# EAGLE design RCT-433-UTR_Transmitter (EAGLE 5.10)
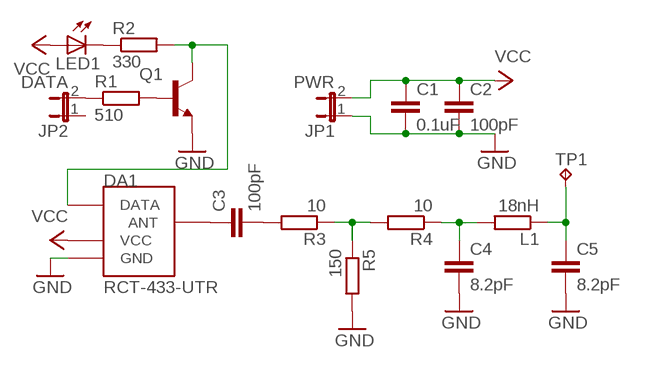
[diagram p0: schematic, sheet 1]

## Parts
C1  0.1uF  C-EUC0805  [C0805]
C2  100pF  C-EUC0805  [C0805]
C3  100pF  C-EUC0805  [C0805]
C4  8.2pF  C-EUC0805  [C0805]
C5  8.2pF  C-EUC0805  [C0805]
DA1  RCT-433-UTR  [RCT-433-UTR]
JP1  PWR  JP1E  [JP1]
JP2  DATA  JP1E  [JP1]
L1  18nH  R-EU_R0805  [R0805]
LED1  LEDCHIP-LED0805  [CHIP-LED0805]
Q1  BC817-16LT1SMD  [SOT23-BEC]
R1  510  R-EU_R0805  [R0805]
R2  330  R-EU_R0805  [R0805]
R3  10  R-EU_R0805  [R0805]
R4  10  R-EU_R0805  [R0805]
R5  150  R-EU_R0805  [R0805]
TP1  TPB2,54  [B2,54]

## Nets
GND: C1.2 C2.2 C4.2 C5.2 DA1.GND JP1.1 Q1.E R5.2
N$1: C3.1 DA1.ANT
N$2: JP2.2 R1.1
N$3: Q1.B R1.2
N$4: LED1.C R2.1
N$5: DA1.DATA Q1.C R2.2
N$6: C3.2 R3.2
N$7: R3.1 R4.2 R5.1
N$8: C5.1 L1.1 TP1.PP(TP)
N$9: C4.1 L1.2 R4.1
VCC: C1.1 C2.1 DA1.VCC JP1.2 LED1.A
Unconnected: JP2.1

## Library data of the parts
C1-C5 = rcl:C-EU: CAPACITOR, European symbol
DA1 = radiotronix:RCT-433-UTR: RCT-433-UTR Radiotronix RCT-433-UTR 433 MHz transmitter. Antenna length = 17.2cm for 433MHz
JP1 JP2 = jumper:JP1E: JUMPER
L1 R1-R5 = resistor:R-EU_: RESISTOR, European symbol
LED1 = led:LED: LED OSRAM: - CHIPLED LG R971, LG N971, LY N971, LG Q971, LY Q971, LO R971, LY R971 LH N974, LH R974 LS Q976, LO Q976, LY Q976 LO Q996 - Hyper CHIPLED LW Q18S LB Q993, LB Q99A, LB R99A - SideLED LS A670, LO A670, LY A670, LG A670, LP A670 LB A673, LV A673, LT A673, LW A673 LH A674 LY A675 LS A676, LA A676, LO A676, LY A676, LW A676 LS A679, LY A679, LG A679 - Hyper Micro SIDELED® LS Y876, LA Y876, LO Y876, LY Y876 LT Y87S - SmartLED LW L88C, LW L88S LB L89C, LB L89S, LG L890 LS L89K, LO L89K, LY L89K LS L896, LA L896, LO L896, LY L896 - TOPLED LS T670, LO T670, LY T670, LG T670, LP T670 LSG T670, LSP T670, LSY T670, LOP T670, LYG T670 LG T671, LOG T671, LSG T671 LB T673, LV T673, LT T673, LW T673 LH T674 LS T676, LA T676, LO T676, LY T676, LB T676, LH T676, LSB T676, LW T676 LB T67C, LV T67C, LT T67C, LS T67K, LO T67K, LY T67K, LW E67C LS E67B, LA E67B, LO E67B, LY E67B, LB E67C, LV E67C, LT E67C LW T67C LS T679, LY T679, LG T679 LS T770, LO T770, LY T770, LG T770, LP T770 LB T773, LV T773, LT T773, LW T773 LH T774 LS E675, LA E675, LY E675, LS T675 LS T776, LA T776, LO T776, LY T776, LB T776 LHGB T686 LT T68C, LB T68C - Hyper Mini TOPLED® LB M676 - Mini TOPLED Santana® LG M470 LS M47K, LO M47K, LY M47K Source: http://www.osram.convergy.de LUXEON: - LUMILED® LXK2-PW12-R00, LXK2-PW12-S00, LXK2-PW14-U00, LXK2-PW14-V00 LXK2-PM12-R00, LXK2-PM12-S00, LXK2-PM14-U00 LXK2-PE12-Q00, LXK2-PE12-R00, LXK2-PE12-S00, LXK2-PE14-T00, LXK2-PE14-U00 LXK2-PB12-K00, LXK2-PB12-L00, LXK2-PB12-M00, LXK2-PB14-N00, LXK2-PB14-P00, LXK2-PB14-Q00 LXK2-PR12-L00, LXK2-PR12-M00, LXK2-PR14-Q00, LXK2-PR14-R00 LXK2-PD12-Q00, LXK2-PD12-R00, LXK2-PD12-S00 LXK2-PH12-R00, LXK2-PH12-S00 LXK2-PL12-P00, LXK2-PL12-Q00, LXK2-PL12-R00 Source: www.luxeon.com KINGBRIGHT: KA-3528ASYC Source: www.kingbright.com
Q1 = transistor-npn:BC817*: NPN Transistor
TP1 = testpad:TP: Test pad

## Board
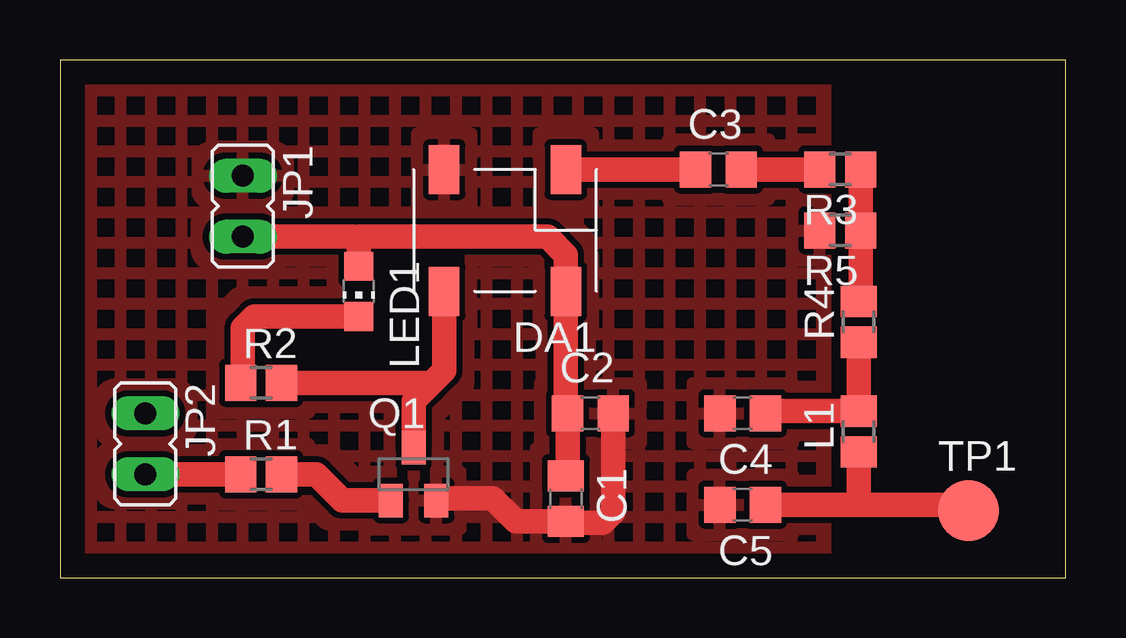
[diagram p1: board, top side]

Size 41.91 x 21.59 mm. Coordinates in mm from the lower left corner, seen from the top.
Outline: 0,0 41.91,0 41.91,21.59 0,21.58 0,0
Copper layers (1*16): Top 0.035mm / dielectric 1.5mm / Bottom 0.035mm
Design rules "default": minimum track width 10mil, minimum drill 24mil, track to track 8mil, track to pad 8mil, pad to pad 8mil, via to via 8mil, smd to smd 8mil, copper to edge 40mil, drill to drill 8mil, minimum pad ring 10mil, minimum via ring 8mil, stop-mask expansion 4mil, vias tented up to drill 0mil, thermal gap 10mil
tRestrict: area 32.4,0 to 41.9,21.6

### Footprints (pad centres in the part's own frame; a part is rotated, then mirrored left to right if it is on the bottom)
C0805 = smd 1.3 x 1.5: 1 -0.95,0; 2 0.95,0
RCT-433-UTR = smd 1.27 x 2.032: ANT 0,0; DATA 5.08,5.08; GND 5.08,0; VCC 0,5.08
JP1 = drill 0.914 long: 1 0,-1.27; 2 0,1.27
R0805 = smd 1.3 x 1.5: 1 -0.85,0; 2 0.85,0
CHIP-LED0805 = smd 1.2 x 1.2: A 0,-1.05; C 0,1.05
SOT23-BEC = smd 1 x 1.4: B -0.95,-1.1; C 0,1.1; E 0.95,-1.1
B2,54 = smd 2.54 x 2.54: PP 0,0

### Placement (x,y rotation side)
C1  21.08,3.3 270 top
C2  22.1,6.86 0 top
C3  27.43,17.02 0 top
C4  28.45,6.86 180 top
C5  28.45,3.05 180 top
DA1  21.08,17.02 180 top
JP1  7.62,15.49 180 top
JP2  3.56,5.59 180 top
L1  33.27,6.1 90 top
LED1  12.45,11.94 180 top
Q1  14.73,4.32 0 top
R1  8.38,4.32 0 top
R2  8.38,8.13 0 top
R3  32.51,17.02 180 top
R4  33.27,10.67 90 top
R5  32.51,14.48 180 top
TP1  37.85,2.79 0 top

### Tracks (layer width: path | path; a pad name or v marks a point on that pad's centre or on a via)
GND
  Top 1.016: C2.2 23.05,2.73 22.61,2.29 21.15,2.29 C1.2 18.98,2.35 18.03,3.3 15.77,3.3 Q1.E
  pour Top (isolate 0.254, hatched): 0,0 0,21.59 41.91,21.59 41.91,0
N$1
  Top 1.016: DA1.ANT C3.1
N$2
  Top 1.016: JP2.2 R1.1
N$3
  Top 1.016: Q1.B 11.77,3.22 10.67,4.32 R1.2
N$4
  Top 1.016: LED1.C 8.09,10.89 7.62,10.41 7.62,8.22 R2.1
N$5
  Top 1.016: DA1.DATA 16,8.64 15.37,8 | 15.37,8 14.73,7.37 Q1.C | R2.2 15.24,8.13 15.37,8
N$6
  Top 1.016: C3.2 R3.2
N$7
  Top 1.016: R3.1 R5.1 33.36,11.61 R4.2
N$8
  Top 1.016: C5.1 33.53,3.05 | 33.53,3.05 37.59,3.05 TP1.PP | L1.1 33.27,3.3 33.53,3.05
N$9
  Top 1.016: R4.1 L1.2 29.49,6.95 C4.1
VCC
  Top 1.016: C1.1 21.15,4.32 C2.1 21.08,6.92 DA1.VCC 21.08,13.46 20.32,14.22 12.45,14.22 LED1.A 12.45,13.97 12.19,14.22 JP1.2